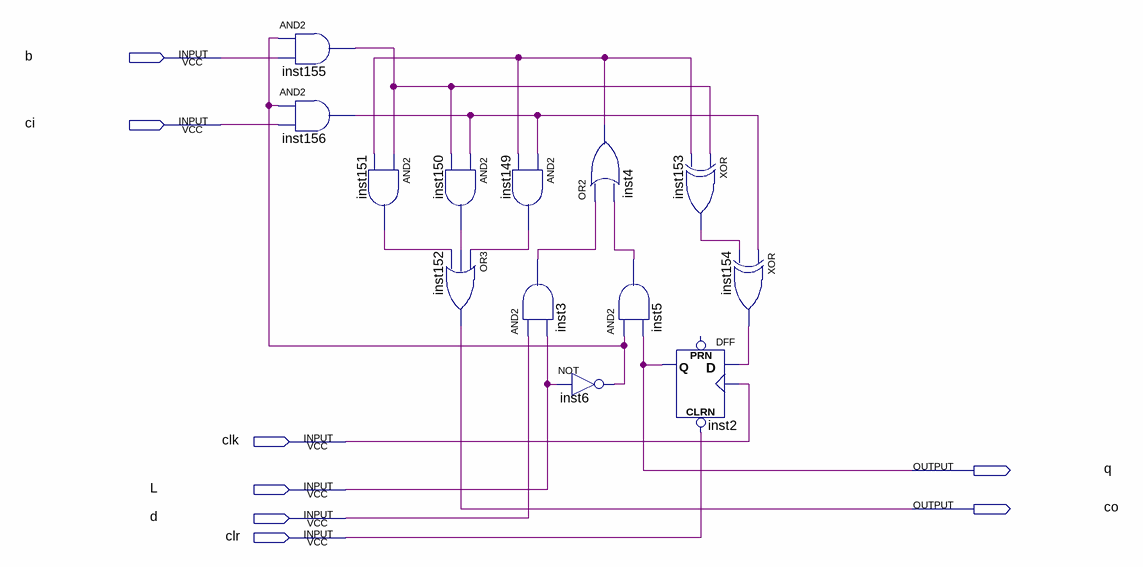
[diagram p0: schematic sheet]
// Quartus schematic jshdy_h.bdf as structural Verilog: 13 symbols, 8 pins
module jshdy_h (
  input  b,
  input  ci,
  input  clk,
  input  L,
  input  d,
  input  clr,
  output q,
  output co
);

  wire inst3_out, inst4_out, inst5_out, inst6_out, inst149_out, inst150_out, inst151_out, inst153_out,
       inst154_out, inst155_out, inst156_out;

  and inst155 (inst155_out, inst6_out, b);
  and inst156 (inst156_out, inst6_out, ci);
  and inst151 (inst151_out, inst155_out, inst4_out);
  and inst150 (inst150_out, inst156_out, inst155_out);
  or inst152 (co, inst149_out, inst150_out, inst151_out);
  and inst149 (inst149_out, inst156_out, inst4_out);
  and inst3 (inst3_out, d, L);
  or inst4 (inst4_out, inst3_out, inst5_out);
  and inst5 (inst5_out, inst6_out, q);
  not inst6 (inst6_out, L);
  xor inst153 (inst153_out, inst155_out, inst4_out);
  DFF inst2 (.CLRN(clr), .CLK(clk), .D(inst154_out), .Q(q));  // open: PRN
  xor inst154 (inst154_out, inst156_out, inst153_out);
endmodule
